# EAGLE design powermeter_without_jack (EAGLE 9.6.2)
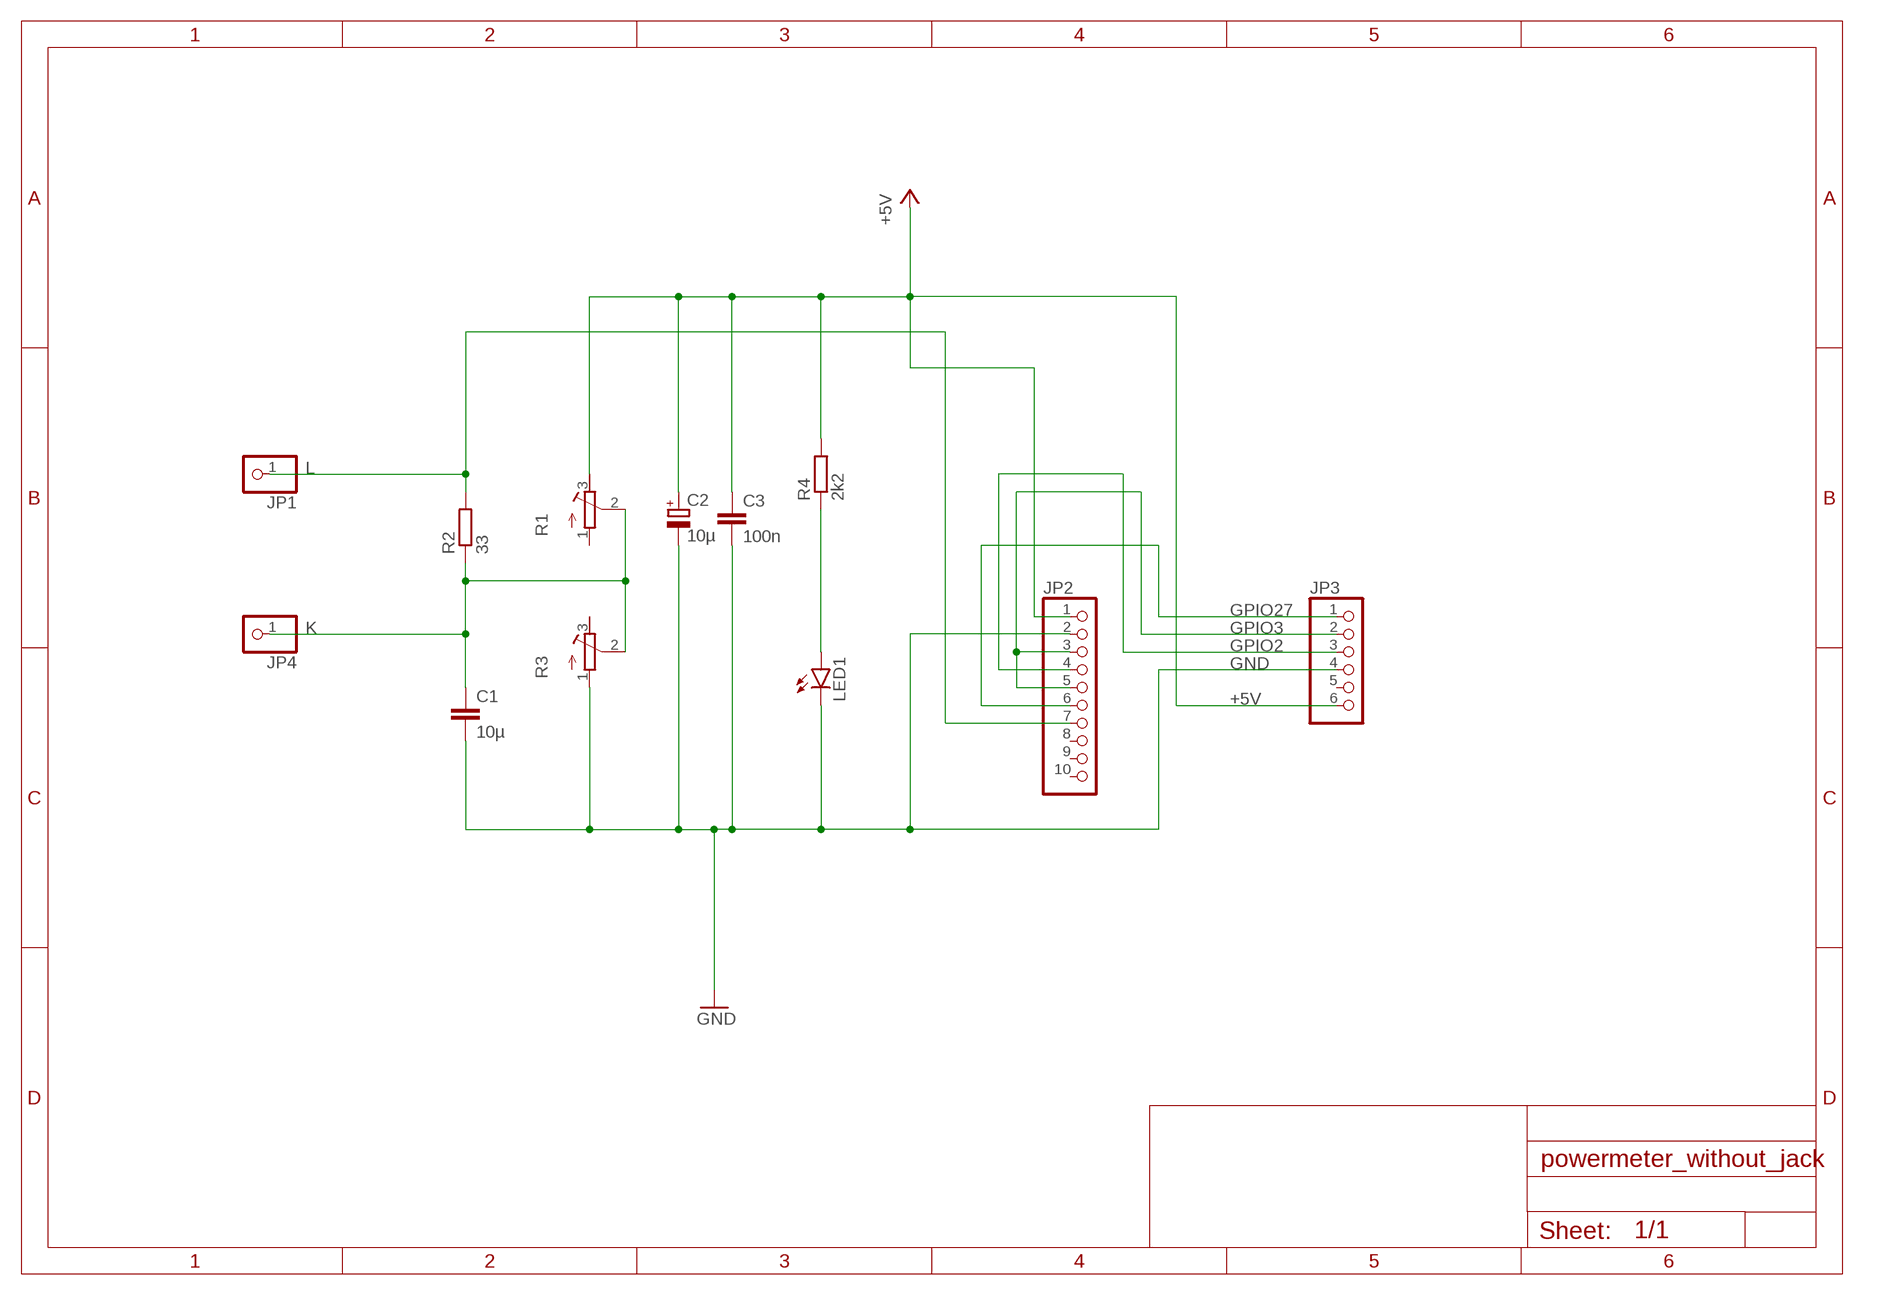
[diagram p0: schematic, sheet 1]

## Parts
C1  10µ  C-EU075-052X106  [C075-052X106]
C2  10µ  CPOL-EUE5-5  [E5-5]
C3  100n  C-EU050-025X075  [C050-025X075]
JP1  PINHD-1X1  [1X01]
JP2  PINHD-1X10  [1X10]
JP3  PINHD-1X6  [1X06]
JP4  PINHD-1X1  [1X01]
LED1  LED3MM  [LED3MM]
R1  R-TRIMM3296W  [RTRIM3296W]
R2  33  R-EU_0411/15  [0411/15]
R3  R-TRIMM3296W  [RTRIM3296W]
R4  2k2  R-EU_0207/10  [0207/10]

## Nets
+5V: C2.+ C3.1 JP2.1 JP3.6 R1.3(E) R4.2
GND: C1.2 C2.- C3.2 JP2.2 JP3.4 LED1.K(C) R3.1(A)
GPIO2: JP2.4 JP3.3
GPIO3: JP2.3 JP2.5 JP3.2
GPIO27: JP2.6 JP3.1
K: C1.1 JP4.1 R1.2(S) R2.1 R3.2(S)
L: JP1.1 JP2.7 R2.2
N$1: LED1.A R4.1
Unconnected: JP2.8 JP2.9 JP2.10 JP3.5 R1.1(A) R3.3(E)

## Library data of the parts
C1 C3 = rcl:C-EU: CAPACITOR, European symbol; SPICEPREFIX: C
C2 = rcl:CPOL-EU: POLARIZED CAPACITOR, European symbol; SPICEPREFIX: C
JP1 JP4 = pinhead:PINHD-1X1: PIN HEADER
JP2 = pinhead:PINHD-1X10: PIN HEADER
JP3 = pinhead:PINHD-1X6: PIN HEADER
LED1 = led:LED: LED OSRAM: - CHIPLED LG R971, LG N971, LY N971, LG Q971, LY Q971, LO R971, LY R971 LH N974, LH R974 LS Q976, LO Q976, LY Q976 LO Q996 - Hyper CHIPLED LW Q18S LB Q993, LB Q99A, LB R99A - SideLED LS A670, LO A670, LY A670, LG A670, LP A670 LB A673, LV A673, LT A673, LW A673 LH A674 LY A675 LS A676, LA A676, LO A676, LY A676, LW A676 LS A679, LY A679, LG A679 - Hyper Micro SIDELED® LS Y876, LA Y876, LO Y876, LY Y876 LT Y87S - SmartLED LW L88C, LW L88S LB L89C, LB L89S, LG L890 LS L89K, LO L89K, LY L89K LS L896, LA L896, LO L896, LY L896 - TOPLED LS T670, LO T670, LY T670, LG T670, LP T670 LSG T670, LSP T670, LSY T670, LOP T670, LYG T670 LG T671, LOG T671, LSG T671 LB T673, LV T673, LT T673, LW T673 LH T674 LS T676, LA T676, LO T676, LY T676, LB T676, LH T676, LSB T676, LW T676 LB T67C, LV T67C, LT T67C, LS T67K, LO T67K, LY T67K, LW E67C LS E67B, LA E67B, LO E67B, LY E67B, LB E67C, LV E67C, LT E67C LW T67C LS T679, LY T679, LG T679 LS T770, LO T770, LY T770, LG T770, LP T770 LB T773, LV T773, LT T773, LW T773 LH T774 LS E675, LA E675, LY E675, LS T675 LS T776, LA T776, LO T776, LY T776, LB T776 LHGB T686 LT T68C, LB T68C - Hyper Mini TOPLED® LB M676 - Mini TOPLED Santana® LG M470 LS M47K, LO M47K, LY M47K Source: http://www.osram.convergy.de LUXEON: - LUMILED® LXK2-PW12-R00, LXK2-PW12-S00, LXK2-PW14-U00, LXK2-PW14-V00 LXK2-PM12-R00, LXK2-PM12-S00, LXK2-PM14-U00 LXK2-PE12-Q00, LXK2-PE12-R00, LXK2-PE12-S00, LXK2-PE14-T00, LXK2-PE14-U00 LXK2-PB12-K00, LXK2-PB12-L00, LXK2-PB12-M00, LXK2-PB14-N00, LXK2-PB14-P00, LXK2-PB14-Q00 LXK2-PR12-L00, LXK2-PR12-M00, LXK2-PR14-Q00, LXK2-PR14-R00 LXK2-PD12-Q00, LXK2-PD12-R00, LXK2-PD12-S00 LXK2-PH12-R00, LXK2-PH12-S00 LXK2-PL12-P00, LXK2-PL12-Q00, LXK2-PL12-R00 Source: www.luxeon.com KINGBRIGHT: KA-3528ASYC Source: www.kingbright.com
R1 R3 = rcl:R-TRIMM: Trimm resistor; SPICEMODEL: X; SPICEPREFIXL: POT
R2 R4 = rcl:R-EU_: RESISTOR, European symbol; SPICEPREFIX: R

## Board
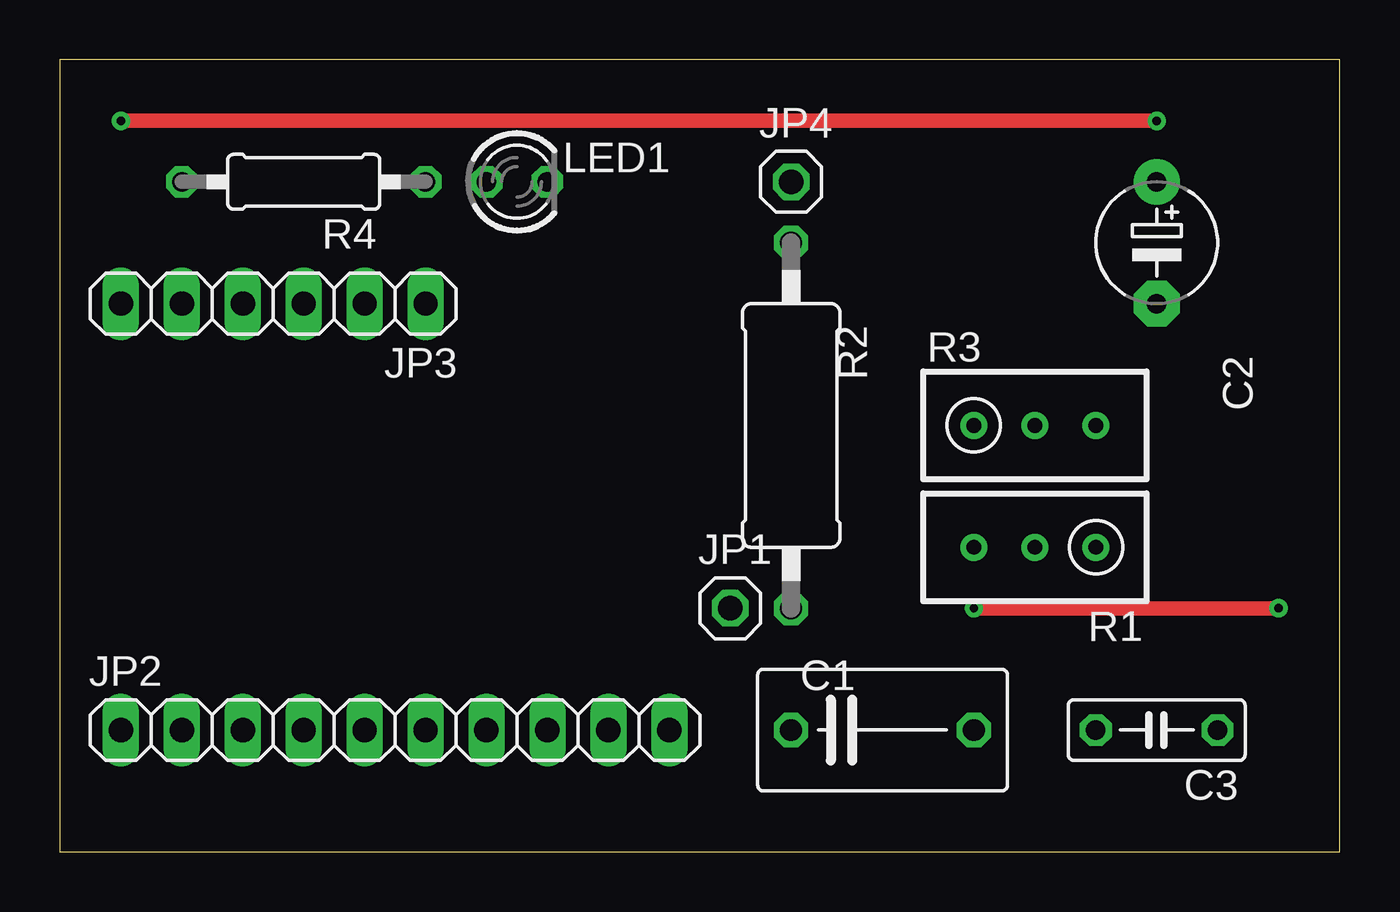
[diagram p1: board, top side]
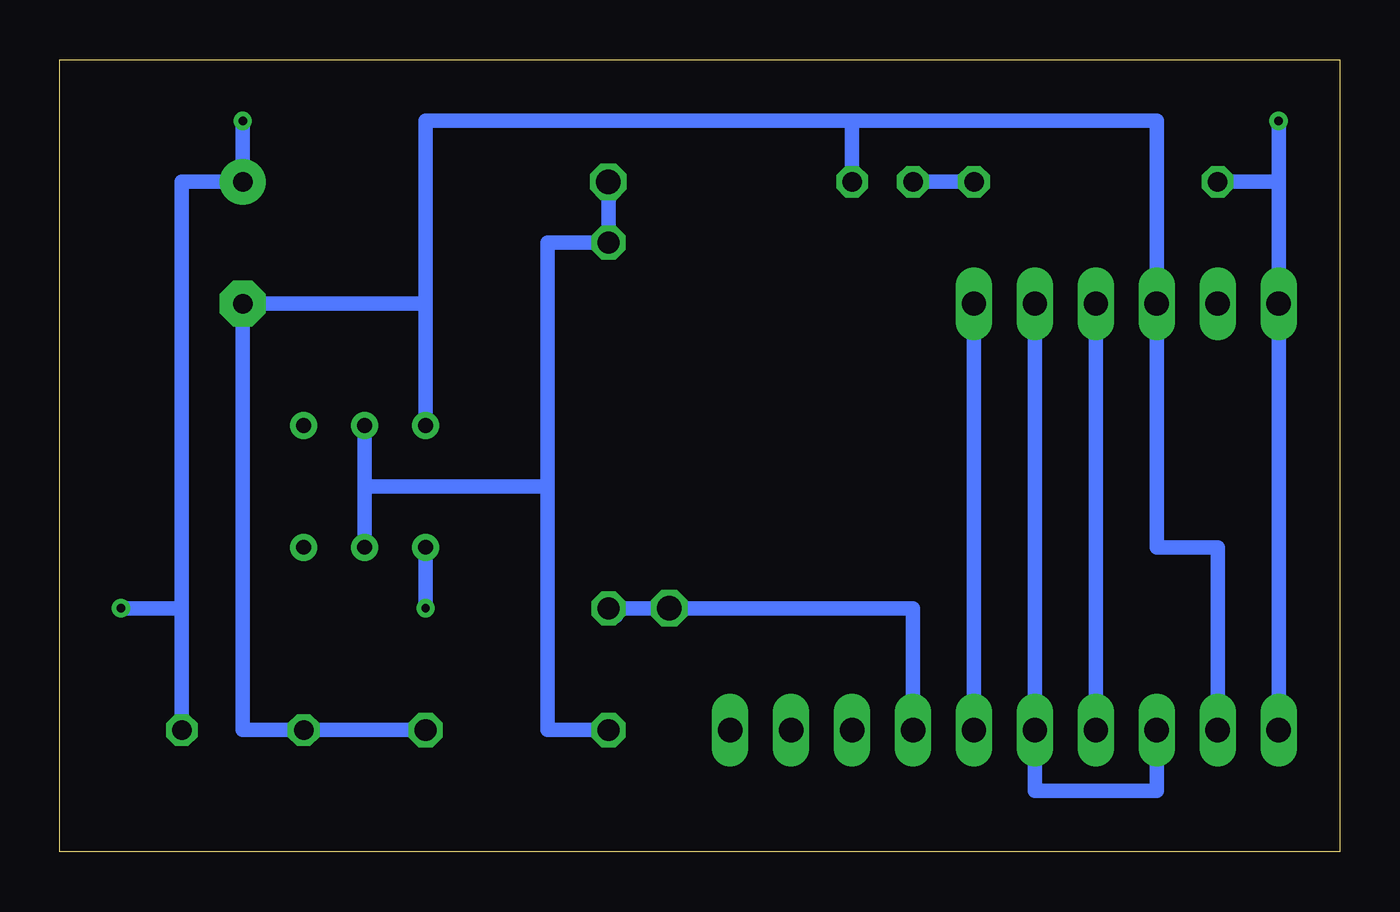
[diagram p2: board, bottom side, seen from below]

Size 53.34 x 33.02 mm. Coordinates in mm from the lower left corner, seen from the top.
Outline: 0,0 53.34,0 53.34,33.02 0,33.02 0,0
Copper layers (1*16): Top 0.035mm / dielectric 1.5mm / Bottom 0.035mm
Design rules "default": minimum track width 6mil, minimum drill 0.35mm, track to track 6mil, track to pad 6mil, pad to pad 6mil, via to via 6mil, smd to smd 6mil, copper to edge 40mil, drill to drill 6mil, minimum pad ring 10mil, minimum via ring 8mil, stop-mask expansion 4mil, vias tented up to drill 0mil, thermal gap 10mil
tKeepout: area 0,2.5 to 27.9,22.9

### Footprints (pad centres in the part's own frame; a part is rotated, then mirrored left to right if it is on the bottom)
C075-052X106 = drill 0.914 octagon: 1 -3.81,0; 2 3.81,0
E5-5 = drill 0.813 pad 1.905: + -2.54,0 | drill 0.813 pad 1.905 octagon: - 2.54,0
C050-025X075 = drill 0.813 octagon: 1 -2.54,0; 2 2.54,0
1X01 = drill 1.016 octagon: 1 0,0
1X10 = drill 1.016 long: 1 -11.43,0; 2 -8.89,0; 3 -6.35,0; 4 -3.81,0; 5 -1.27,0; 6 1.27,0; 7 3.81,0; 8 6.35,0; 9 8.89,0; 10 11.43,0
1X06 = drill 1.016 long: 1 -6.35,0; 2 -3.81,0; 3 -1.27,0; 4 1.27,0; 5 3.81,0; 6 6.35,0
LED3MM = drill 0.813 octagon: A -1.27,0; K 1.27,0
RTRIM3296W = drill 0.61: 1 0,-2.54; 2 0,0; 3 0,2.54
0411/15 = drill 0.914 octagon: 1 -7.62,0; 2 7.62,0
0207/10 = drill 0.813 octagon: 1 -5.08,0; 2 5.08,0

### Placement (x,y rotation side)
C1  34.29,5.08 0 top
C2  45.72,25.4 270 top
C3  45.72,5.08 180 top
JP1  27.94,10.16 0 top
JP2  13.97,5.08 0 top
JP3  8.89,22.86 180 top
JP4  30.48,27.94 0 top
LED1  19.05,27.94 0 top
R1  40.64,12.7 90 top
R2  30.48,17.78 270 top
R3  40.64,17.78 270 top
R4  10.16,27.94 180 top

### Tracks (layer width: path | path; a pad name or v marks a point on that pad's centre or on a via)
+5V  (via drill 0.35)
  Top 0.61: v2.54,30.48 v45.72,30.48 | v50.8,10.16 v38.1,10.16
  Bottom 0.61: 48.26,10.16 48.26,27.94 C2.+ v45.72,30.48 | C3.1 48.26,10.16 | JP2.1 JP3.6 2.54,27.94 | R1.3 v38.1,10.16 | v2.54,30.48 2.54,27.94 | 48.26,10.16 v50.8,10.16 | R4.2 2.54,27.94
GND
  Bottom 0.61: 38.1,22.86 C2.- 45.72,5.08 C3.2 C1.2 | 38.1,22.86 38.1,30.48 20.32,30.48 | JP2.2 5.08,12.7 7.62,12.7 JP3.4 7.62,30.48 20.32,30.48 | R3.1 38.1,22.86 | LED1.K 20.32,30.48
GPIO2
  Bottom 0.61: JP2.4 JP3.3
GPIO3
  Bottom 0.61: JP3.2 JP2.5 12.7,2.54 7.62,2.54 JP2.3
GPIO27
  Bottom 0.61: JP2.6 JP3.1
K
  Bottom 0.61: C1.1 33.02,5.08 33.02,15.24 | R3.2 40.64,15.24 | 40.64,15.24 R1.2 | 33.02,15.24 40.64,15.24 | JP4.1 R2.1 33.02,25.4 33.02,15.24
L
  Bottom 0.61: JP2.7 17.78,10.16 JP1.1 R2.2 30.16,9.84
N$1
  Bottom 0.61: R4.1 LED1.A